# Altium schematic sheet hcpl0630.SchDoc
size A4
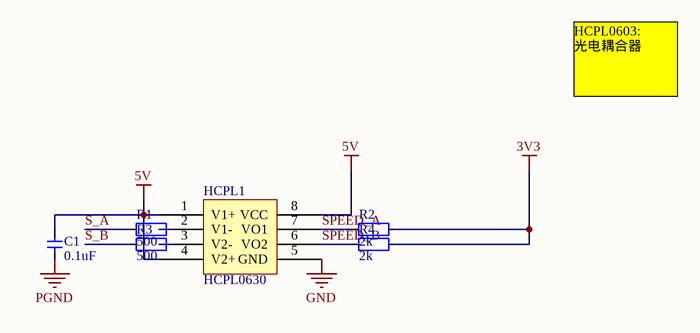
[diagram p0: hcpl0630.SchDoc]

## Parts
C1  value 0.1uF  [CAP_0603]  (hidden comment: Cap_0603)
HCPL1  HCPL0630  [SOP_E150_8]
R1  value 500  [RES_0603]  (hidden comment: Res_0603)
R2  value 2k  [RES_0603]  (hidden comment: Res_0603)
R3  value 500  [RES_0603]  (hidden comment: Res_0603)
R4  value 2k  [RES_0603]  (hidden comment: Res_0603)

## Nets
3V3: R2.1 R4.1
5V: C1.2 HCPL1.1(V1+) HCPL1.4(V2+) HCPL1.8(VCC)
GND: HCPL1.5(GND)
PGND: C1.1
S_A: R1.2
S_B: R3.2
SPEED_A: HCPL1.7(VO1) R2.2
SPEED_B: HCPL1.6(VO2) R4.2
NetHCPL1_2: HCPL1.2(V1-) R1.1
NetHCPL1_3: HCPL1.3(V2-) R3.1

## Notes on the sheet
- HCPL0603:
  光电耦合器

## Library data of the parts
C1 = Cap_0603: Capacitor
R1-R4 = Res_0603: Resistor